# EAGLE schematic IOIO Unrouted (EAGLE 5.11)
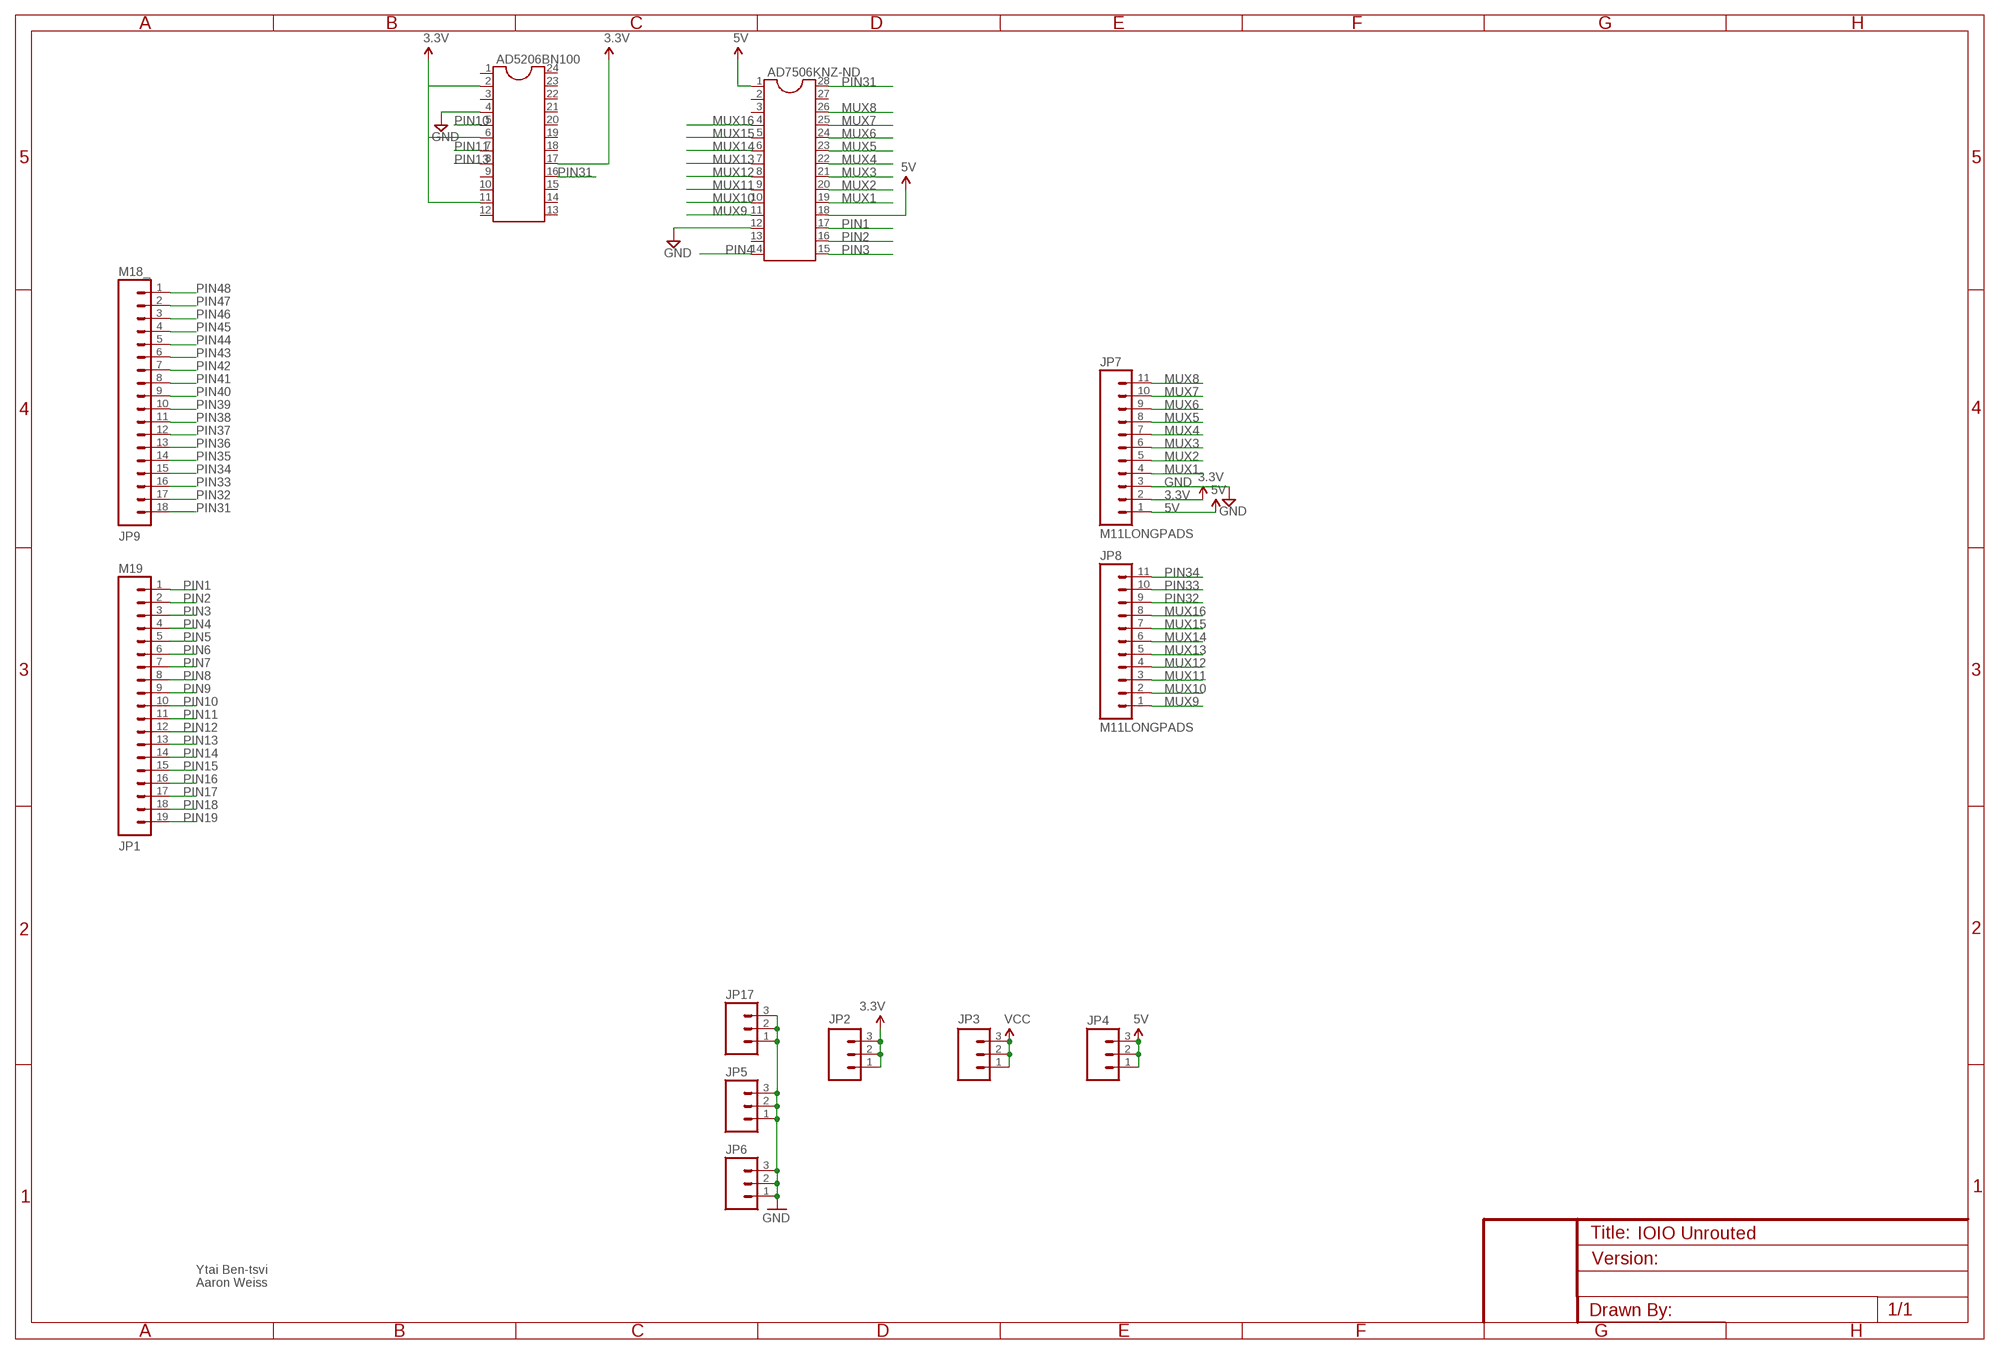
[diagram p0: schematic, sheet 1]

## Parts
AD5206BN100  DIL24-3  [DIL24-3]
AD7506KNZ-ND  DIL28  [DIL28-6]
JP1  M19  [1X19]
JP2  M03PTH  [1X03]
JP3  M03PTH  [1X03]
JP4  M03PTH  [1X03]
JP5  M03PTH  [1X03]
JP6  M03PTH  [1X03]
JP7  M11LONGPADS  [1X11_LONGPADS]
JP8  M11LONGPADS  [1X11_LONGPADS]
JP9  M18_  [1X18]
JP17  M03PTH  [1X03]

## Nets
3.3V: AD5206BN100.2 AD5206BN100.6 AD5206BN100.11 AD5206BN100.17 JP2.1 JP2.2 JP2.3 JP7.2
5V: AD7506KNZ-ND.1 AD7506KNZ-ND.18 JP4.1 JP4.2 JP4.3 JP7.1
GND: AD5206BN100.4 AD7506KNZ-ND.12 JP5.1 JP5.2 JP5.3 JP6.1 JP6.2 JP6.3 JP7.3 JP17.1 JP17.2 JP17.3
MUX1: AD7506KNZ-ND.19 JP7.4
MUX2: AD7506KNZ-ND.20 JP7.5
MUX3: AD7506KNZ-ND.21 JP7.6
MUX4: AD7506KNZ-ND.22 JP7.7
MUX5: AD7506KNZ-ND.23 JP7.8
MUX6: AD7506KNZ-ND.24 JP7.9
MUX7: AD7506KNZ-ND.25 JP7.10
MUX8: AD7506KNZ-ND.26 JP7.11
MUX9: AD7506KNZ-ND.11 JP8.1
MUX10: AD7506KNZ-ND.10 JP8.2
MUX11: AD7506KNZ-ND.9 JP8.3
MUX12: AD7506KNZ-ND.8 JP8.4
MUX13: AD7506KNZ-ND.7 JP8.5
MUX14: AD7506KNZ-ND.6 JP8.6
MUX15: AD7506KNZ-ND.5 JP8.7
MUX16: AD7506KNZ-ND.4 JP8.8
PIN1: AD7506KNZ-ND.17 JP1.1
PIN2: AD7506KNZ-ND.16 JP1.2
PIN3: AD7506KNZ-ND.15 JP1.3
PIN4: AD7506KNZ-ND.14 JP1.4
PIN5: JP1.5
PIN6: JP1.6
PIN7: JP1.7
PIN8: JP1.8
PIN9: JP1.9
PIN10: AD5206BN100.5 JP1.10
PIN11: AD5206BN100.7 JP1.11
PIN12: JP1.12
PIN13: AD5206BN100.8 JP1.13
PIN14: JP1.14
PIN15: JP1.15
PIN16: JP1.16
PIN17: JP1.17
PIN18: JP1.18
PIN19: JP1.19
PIN31: AD5206BN100.16 AD7506KNZ-ND.28 JP9.18
PIN32: JP8.9 JP9.17
PIN33: JP8.10 JP9.16
PIN34: JP8.11 JP9.15
PIN35: JP9.14
PIN36: JP9.13
PIN37: JP9.12
PIN38: JP9.11
PIN39: JP9.10
PIN40: JP9.9
PIN41: JP9.8
PIN42: JP9.7
PIN43: JP9.6
PIN44: JP9.5
PIN45: JP9.4
PIN46: JP9.3
PIN47: JP9.2
PIN48: JP9.1
VCC: JP3.1 JP3.2 JP3.3
Unconnected: AD5206BN100.1 AD5206BN100.3 AD5206BN100.9 AD5206BN100.10 AD5206BN100.12 AD5206BN100.13 AD5206BN100.14 AD5206BN100.15 AD5206BN100.18 AD5206BN100.19 AD5206BN100.20 AD5206BN100.21 AD5206BN100.22 AD5206BN100.23 AD5206BN100.24 AD7506KNZ-ND.2 AD7506KNZ-ND.3 AD7506KNZ-ND.13 AD7506KNZ-ND.27

## Notes on the sheet
- Ytai Ben-tsvi
- Aaron Weiss

## Library data of the parts
AD5206BN100 = ic-package:DIL24: Dual In Line
AD7506KNZ-ND = ic-package:DIL28: Dual In Line
JP1 = SparkFun:M19
JP2-JP6 JP17 = SparkFun:M03: Header 3 Standard 3-pin 0.1" header. Use with straight break away headers (SKU : PRT-00116), right angle break away headers (PRT-00553), swiss pins (PRT-00743), machine pins (PRT-00117), and female headers (PRT-00115). Molex polarized connector foot print use with SKU : PRT-08232 with associated crimp pins and housings.
JP7 JP8 = SparkFun:M11: Header 11 Standard 11-pin 0.1" header. Use with straight break away headers (SKU : PRT-00116), right angle break away headers (PRT-00553), swiss pins (PRT-00743), machine pins (PRT-00117), and female headers (PRT-00115).
JP9 = SparkFun:M18